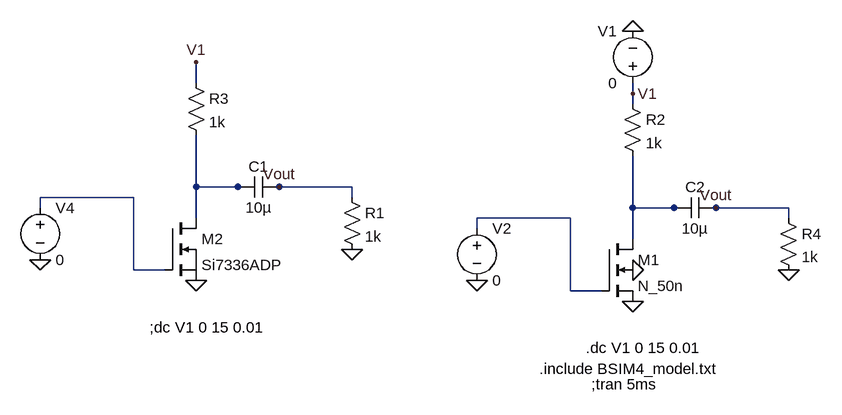
[diagram p0: schematic Aec_project_Vth.asc]
Aec_project_Vth.asc, the LTspice schematic file:
Version 4
SHEET 1 1000 680
WIRE -288 -32 -288 -64
WIRE 384 -16 384 -32
WIRE 384 0 384 -16
WIRE -288 128 -288 48
WIRE -224 128 -288 128
WIRE -208 128 -224 128
WIRE -160 128 -176 128
WIRE -48 128 -160 128
WIRE -384 144 -528 144
WIRE -48 144 -48 128
WIRE -528 160 -528 144
WIRE 384 160 384 80
WIRE 448 160 384 160
WIRE 464 160 448 160
WIRE 512 160 496 160
WIRE 624 160 512 160
WIRE -288 176 -288 128
WIRE 288 176 144 176
WIRE 624 176 624 160
WIRE 144 192 144 176
WIRE 384 208 384 160
WIRE -384 256 -384 144
WIRE -336 256 -384 256
WIRE 288 288 288 176
WIRE 336 288 288 288
FLAG 384 304 0
FLAG 512 160 Vout
FLAG 624 256 0
FLAG 384 -112 0
FLAG 384 256 0
FLAG 144 272 0
FLAG -288 272 0
FLAG -160 128 Vout
FLAG -48 224 0
FLAG -528 240 0
FLAG -288 -64 V1
FLAG 384 -16 V1
SYMBOL cap 512 144 R90
WINDOW 0 0 32 VBottom 2
WINDOW 3 32 32 VTop 2
SYMATTR InstName C2
SYMATTR Value 10µ
SYMBOL res 608 160 R0
SYMATTR InstName R4
SYMATTR Value 1k
SYMBOL voltage 384 -16 R180
WINDOW 0 24 96 Left 2
WINDOW 3 24 16 Left 2
WINDOW 123 0 0 Left 0
WINDOW 39 0 0 Left 0
SYMATTR InstName V1
SYMATTR Value 0
SYMBOL res 368 -16 R0
SYMATTR InstName R2
SYMATTR Value 1k
SYMBOL nmos4 336 208 R0
SYMATTR InstName M1
SYMATTR Value2 l=50n w=500n
SYMATTR Value N_50n
SYMBOL voltage 144 176 R0
WINDOW 123 0 0 Left 0
WINDOW 39 0 0 Left 0
SYMATTR InstName V2
SYMATTR Value 0
SYMBOL cap -160 112 R90
WINDOW 0 0 32 VBottom 2
WINDOW 3 32 32 VTop 2
SYMATTR InstName C1
SYMATTR Value 10µ
SYMBOL res -64 128 R0
SYMATTR InstName R1
SYMATTR Value 1k
SYMBOL res -304 -48 R0
SYMATTR InstName R3
SYMATTR Value 1k
SYMBOL voltage -528 144 R0
WINDOW 123 0 0 Left 0
WINDOW 39 0 0 Left 0
SYMATTR InstName V4
SYMATTR Value 0
SYMBOL nmos -336 176 R0
SYMATTR InstName M2
SYMATTR Value Si7336ADP
TEXT 312 376 Left 2 !.dc V1 0 15 0.01
TEXT 320 432 Left 2 !;tran 5ms
TEXT 240 408 Left 2 !.include BSIM4_model.txt
TEXT -360 344 Left 2 !;dc V1 0 15 0.01

The netlist it stands for:
* Aec_project_Vth.asc
C2 Vout N003 10µ
R4 Vout 0 1k
V1 V1 0 0
R2 V1 N003 1k
M1 N003 N004 0 0 N_50n l=50n w=500n
V2 N004 0 0
C1 Vout N001 10µ
R1 Vout 0 1k
R3 V1 N001 1k
V4 N002 0 0
M2 N001 N002 0 0 Si7336ADP
.model NMOS NMOS
.model PMOS PMOS
.lib standard.mos
.dc V1 0 15 0.01
;tran 5ms
.include BSIM4_model.txt
;dc V1 0 15 0.01
.backanno
.end